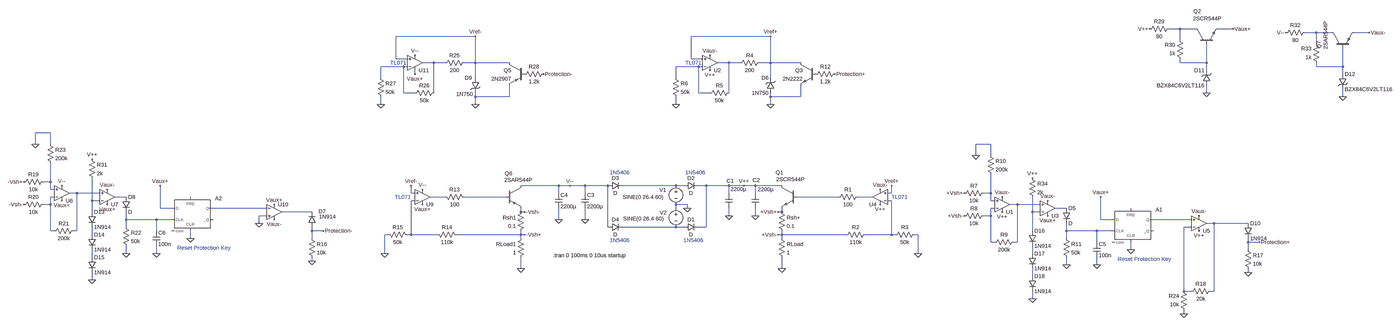
[diagram p0: schematic PSU_Schm.asc, whole sheet]
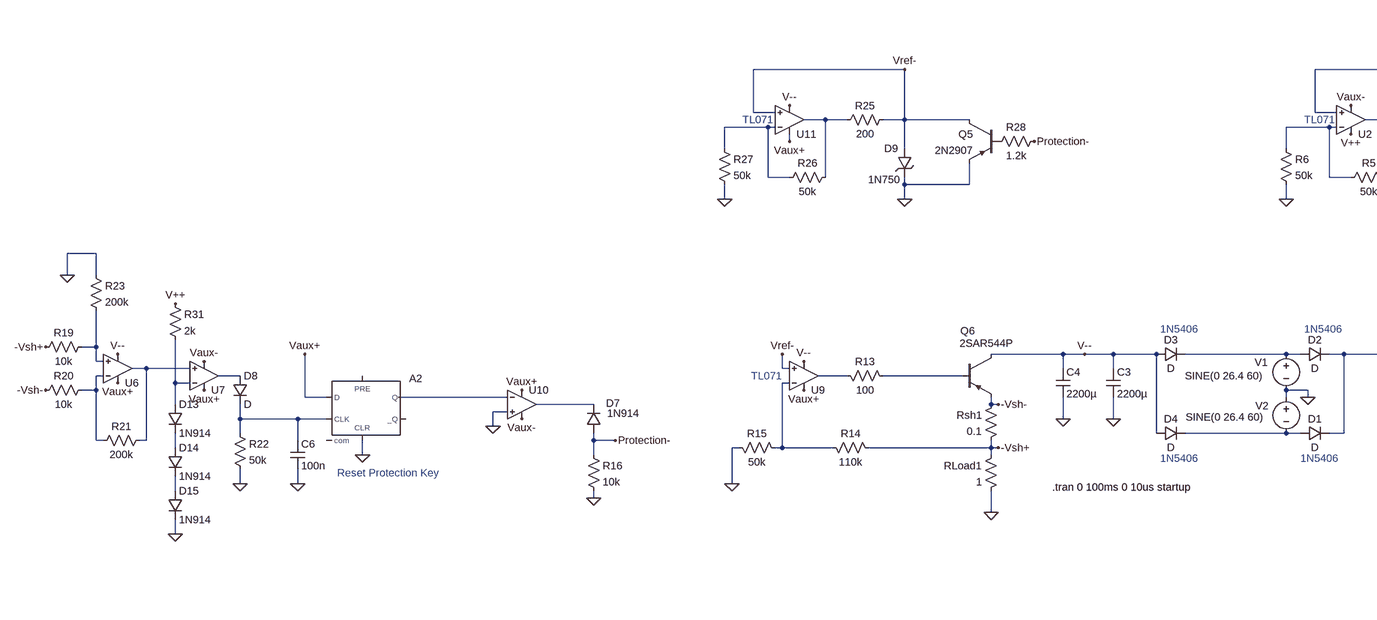
[diagram p1: schematic PSU_Schm.asc, part, row 1 of 1, column 1 of 2]
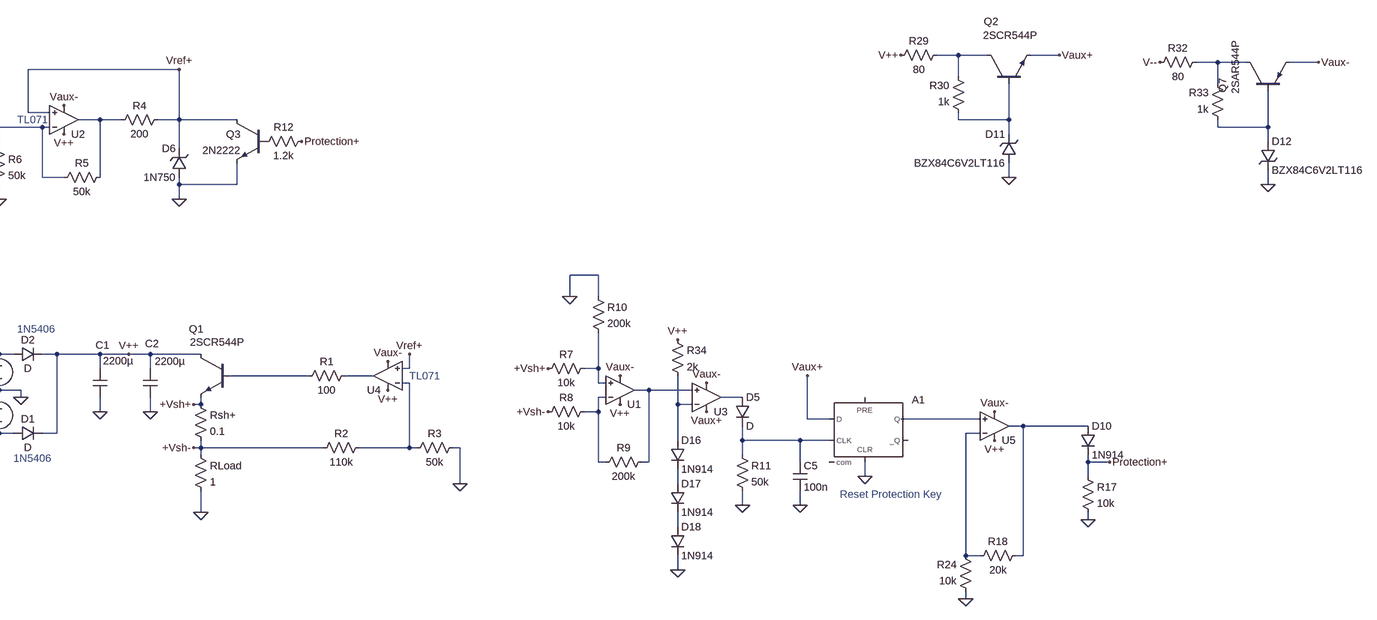
[diagram p2: schematic PSU_Schm.asc, part, row 1 of 1, column 2 of 2]
PSU_Schm.asc, the LTspice schematic file:
Version 4
SHEET 1 3240 692
WIRE 2288 -752 2240 -752
WIRE 2352 -752 2288 -752
WIRE 2512 -752 2448 -752
WIRE 2864 -736 2816 -736
WIRE 2928 -736 2864 -736
WIRE 3088 -736 3024 -736
WIRE -912 -720 -1248 -720
WIRE 336 -720 0 -720
WIRE 2288 -704 2288 -752
WIRE 2864 -688 2864 -736
WIRE -1248 -624 -1248 -720
WIRE -1200 -624 -1248 -624
WIRE 0 -624 0 -720
WIRE 48 -624 0 -624
WIRE -1088 -608 -1136 -608
WIRE -1040 -608 -1088 -608
WIRE -912 -608 -912 -720
WIRE -912 -608 -960 -608
WIRE -768 -608 -912 -608
WIRE 160 -608 112 -608
WIRE 208 -608 160 -608
WIRE 336 -608 336 -720
WIRE 336 -608 288 -608
WIRE 464 -608 336 -608
WIRE 2288 -608 2288 -624
WIRE 2400 -608 2400 -688
WIRE 2400 -608 2288 -608
WIRE -1216 -592 -1312 -592
WIRE -1200 -592 -1216 -592
WIRE 32 -592 -64 -592
WIRE 48 -592 32 -592
WIRE 2864 -592 2864 -608
WIRE 2976 -592 2976 -672
WIRE 2976 -592 2864 -592
WIRE 2400 -576 2400 -608
WIRE -1168 -560 -1168 -576
WIRE 2976 -560 2976 -592
WIRE -1312 -544 -1312 -592
WIRE -912 -544 -912 -608
WIRE -64 -544 -64 -592
WIRE 336 -544 336 -608
WIRE -1216 -480 -1216 -592
WIRE -1168 -480 -1216 -480
WIRE -1088 -480 -1088 -608
WIRE 32 -480 32 -592
WIRE 80 -480 32 -480
WIRE 160 -480 160 -608
WIRE 2400 -480 2400 -512
WIRE -912 -464 -912 -480
WIRE -768 -464 -768 -512
WIRE -768 -464 -912 -464
WIRE 336 -464 336 -480
WIRE 464 -464 464 -512
WIRE 464 -464 336 -464
WIRE 2976 -464 2976 -496
WIRE -1312 -432 -1312 -464
WIRE -912 -432 -912 -464
WIRE -64 -432 -64 -464
WIRE 336 -432 336 -464
WIRE -2944 -144 -3008 -144
WIRE -3008 -96 -3008 -144
WIRE -2944 -96 -2944 -144
WIRE 1488 -96 1424 -96
WIRE 1424 -48 1424 -96
WIRE 1488 -48 1488 -96
WIRE -2944 64 -2944 -16
WIRE -2944 64 -2976 64
WIRE -560 80 -720 80
WIRE -512 80 -560 80
WIRE -448 80 -512 80
WIRE -352 80 -448 80
WIRE -64 80 -288 80
WIRE -32 80 -64 80
WIRE 64 80 32 80
WIRE 160 80 64 80
WIRE 224 80 160 80
WIRE 272 80 224 80
WIRE 384 80 272 80
WIRE -2944 96 -2944 64
WIRE -2928 96 -2944 96
WIRE -2832 112 -2864 112
WIRE -2736 112 -2832 112
WIRE -1184 112 -1184 80
WIRE -1168 112 -1184 112
WIRE -560 112 -560 80
WIRE -448 112 -448 80
WIRE 160 112 160 80
WIRE 272 112 272 80
WIRE 848 112 848 80
WIRE 848 112 832 112
WIRE 1488 112 1488 32
WIRE 1488 112 1456 112
WIRE -2928 128 -2944 128
WIRE -2624 128 -2672 128
WIRE -1040 128 -1104 128
WIRE -784 128 -960 128
WIRE 624 128 448 128
WIRE 768 128 704 128
WIRE -2768 144 -2768 48
WIRE -2736 144 -2768 144
WIRE -1168 144 -1184 144
WIRE 848 144 832 144
WIRE 1488 144 1488 112
WIRE 1504 144 1488 144
WIRE -2944 160 -2944 128
WIRE -2944 160 -2976 160
WIRE -16 160 -64 160
WIRE 1600 160 1568 160
WIRE 1696 160 1600 160
WIRE -2480 176 -2480 80
WIRE -2432 176 -2480 176
WIRE -2000 176 -2272 176
WIRE -64 176 -64 160
WIRE -16 176 -16 160
WIRE 1504 176 1488 176
WIRE 1808 176 1760 176
WIRE -2768 192 -2768 144
WIRE -1808 192 -1936 192
WIRE -720 192 -720 176
WIRE -704 192 -720 192
WIRE 384 192 384 176
WIRE 384 192 368 192
WIRE 1664 192 1664 128
WIRE 1696 192 1664 192
WIRE -2000 208 -2032 208
WIRE 160 208 160 176
WIRE 272 208 272 176
WIRE 1488 208 1488 176
WIRE 1488 208 1456 208
WIRE -2624 224 -2624 192
WIRE -2496 224 -2624 224
WIRE -2432 224 -2496 224
WIRE -560 224 -560 176
WIRE -448 224 -448 176
WIRE 1952 224 1952 128
WIRE 2000 224 1952 224
WIRE 2336 224 2160 224
WIRE -2032 240 -2032 208
WIRE 2432 240 2400 240
WIRE 2576 240 2432 240
WIRE -2624 256 -2624 224
WIRE -352 256 -352 80
WIRE -64 256 -288 256
WIRE -32 256 -64 256
WIRE 64 256 64 80
WIRE 64 256 32 256
WIRE 2336 256 2304 256
WIRE -2944 272 -2944 160
WIRE -2928 272 -2944 272
WIRE -2832 272 -2832 112
WIRE -2832 272 -2848 272
WIRE -2496 272 -2496 224
WIRE -1808 272 -1808 256
WIRE -1760 272 -1808 272
WIRE 1664 272 1664 192
WIRE 1808 272 1808 240
WIRE 1936 272 1808 272
WIRE 2000 272 1936 272
WIRE -2768 288 -2768 256
WIRE -1280 288 -1296 288
WIRE -1184 288 -1184 144
WIRE -1184 288 -1200 288
WIRE -1072 288 -1184 288
WIRE -720 288 -720 272
WIRE -720 288 -992 288
WIRE -704 288 -720 288
WIRE 384 288 384 272
WIRE 384 288 368 288
WIRE 656 288 384 288
WIRE 848 288 848 144
WIRE 848 288 736 288
WIRE 864 288 848 288
WIRE 960 288 944 288
WIRE -2352 304 -2352 272
WIRE -1808 304 -1808 272
WIRE -720 304 -720 288
WIRE 384 304 384 288
WIRE 1808 304 1808 272
WIRE 1488 320 1488 208
WIRE 1504 320 1488 320
WIRE 1600 320 1600 160
WIRE 1600 320 1584 320
WIRE 1936 320 1936 272
WIRE 2576 320 2576 304
WIRE 2624 320 2576 320
WIRE 2080 352 2080 320
WIRE 2576 352 2576 320
WIRE -2624 368 -2624 336
WIRE -2496 368 -2496 336
WIRE -1296 368 -1296 288
WIRE 960 368 960 288
WIRE 1664 368 1664 336
WIRE -2768 384 -2768 352
WIRE -1808 400 -1808 384
WIRE 1808 416 1808 384
WIRE 1936 416 1936 384
WIRE -720 432 -720 384
WIRE 384 432 384 384
WIRE 2576 448 2576 432
WIRE 1664 464 1664 432
WIRE -2768 480 -2768 448
WIRE 2304 528 2304 256
WIRE 2336 528 2304 528
WIRE 2432 528 2432 240
WIRE 2432 528 2416 528
WIRE 1664 560 1664 528
WIRE 2304 624 2304 608
FLAG 160 208 0
FLAG 272 208 0
FLAG -448 224 0
FLAG -560 224 0
FLAG -16 176 0
FLAG 384 432 0
FLAG 224 80 V++
FLAG 800 160 V++
FLAG -512 80 V--
FLAG 800 96 Vaux-
FLAG 960 368 0
FLAG 336 -432 0
FLAG -64 -432 0
FLAG 336 -720 Vref+
FLAG 848 80 Vref+
FLAG 368 192 +Vsh+
FLAG 368 288 +Vsh-
FLAG 1376 112 +Vsh+
FLAG 1376 208 +Vsh-
FLAG 1536 192 V++
FLAG 1536 128 Vaux-
FLAG 1728 208 Vaux+
FLAG 1728 144 Vaux-
FLAG 1808 416 0
FLAG 1952 128 Vaux+
FLAG 2080 352 0
FLAG 1424 -48 0
FLAG 1936 416 0
FLAG 608 -560 Protection+
FLAG -720 432 0
FLAG -1136 160 Vaux+
FLAG -1136 96 V--
FLAG -1296 368 0
FLAG -704 288 -Vsh+
FLAG -704 192 -Vsh-
FLAG -1184 80 Vref-
FLAG 80 -576 V++
FLAG -3056 64 -Vsh+
FLAG -3056 160 -Vsh-
FLAG -2896 144 Vaux+
FLAG -2896 80 V--
FLAG -2704 160 Vaux+
FLAG -2704 96 Vaux-
FLAG -2768 480 0
FLAG -2624 368 0
FLAG -2480 80 Vaux+
FLAG -2352 304 0
FLAG -3008 -96 0
FLAG -2496 368 0
FLAG -912 -432 0
FLAG -1312 -432 0
FLAG -1168 -640 V--
FLAG -624 -560 Protection-
FLAG -1968 224 Vaux-
FLAG -1968 160 Vaux+
FLAG -1760 272 Protection-
FLAG -1808 400 0
FLAG -912 -720 Vref-
FLAG 2368 208 Vaux-
FLAG 2368 272 V++
FLAG 2624 320 Protection+
FLAG 2576 448 0
FLAG 2304 624 0
FLAG -1168 -560 Vaux+
FLAG 80 -640 Vaux-
FLAG -2032 240 0
FLAG 2400 -480 0
FLAG 2160 -752 V++
FLAG 2976 -464 0
FLAG 2736 -736 V--
FLAG 2512 -752 Vaux+
FLAG 3088 -736 Vaux-
FLAG -2768 -32 V++
FLAG 1664 560 0
FLAG 1664 48 V++
SYMBOL cap 144 112 R0
WINDOW 0 6 -52 Left 2
WINDOW 3 23 -17 Left 2
SYMATTR InstName C1
SYMATTR Value 2200µ
SYMBOL cap 256 112 R0
WINDOW 0 4 -55 Left 2
WINDOW 3 26 -16 Left 2
SYMATTR InstName C2
SYMATTR Value 2200µ
SYMBOL diode -32 272 R270
WINDOW 0 32 32 VTop 2
WINDOW 3 0 32 VBottom 2
SYMATTR InstName D1
SYMBOL diode -32 96 R270
WINDOW 0 32 32 VTop 2
WINDOW 3 0 32 VBottom 2
SYMATTR InstName D2
SYMBOL voltage -64 64 R0
WINDOW 0 -70 34 Left 2
WINDOW 3 -225 64 Left 2
WINDOW 123 0 0 Left 0
WINDOW 39 0 0 Left 0
SYMATTR InstName V1
SYMATTR Value SINE(0 26.4 60)
SYMBOL voltage -64 160 R0
WINDOW 0 -68 35 Left 2
WINDOW 3 -223 60 Left 2
WINDOW 123 0 0 Left 0
WINDOW 39 0 0 Left 0
SYMATTR InstName V2
SYMATTR Value SINE(0 26.4 60)
SYMBOL diode -352 96 R270
WINDOW 0 32 32 VTop 2
WINDOW 3 0 32 VBottom 2
SYMATTR InstName D3
SYMBOL diode -352 272 R270
WINDOW 0 32 32 VTop 2
WINDOW 3 0 32 VBottom 2
SYMATTR InstName D4
SYMBOL cap -464 112 R0
SYMATTR InstName C3
SYMATTR Value 2200µ
SYMBOL cap -576 112 R0
SYMATTR InstName C4
SYMATTR Value 2200µ
SYMBOL res 368 288 R0
SYMATTR InstName RLoad
SYMATTR Value 1
SYMBOL res 720 112 R90
WINDOW 0 0 56 VBottom 2
WINDOW 3 32 56 VTop 2
SYMATTR InstName R1
SYMATTR Value 100
SYMBOL res 752 272 R90
WINDOW 0 0 56 VBottom 2
WINDOW 3 32 56 VTop 2
SYMATTR InstName R2
SYMATTR Value 110k
SYMBOL res 960 272 R90
WINDOW 0 0 56 VBottom 2
WINDOW 3 32 56 VTop 2
SYMATTR InstName R3
SYMATTR Value 50k
SYMBOL res 304 -624 R90
WINDOW 0 0 56 VBottom 2
WINDOW 3 32 56 VTop 2
SYMATTR InstName R4
SYMATTR Value 200
SYMBOL res 176 -496 R90
WINDOW 0 0 56 VBottom 2
WINDOW 3 32 56 VTop 2
SYMATTR InstName R5
SYMATTR Value 50k
SYMBOL res -80 -560 R0
SYMATTR InstName R6
SYMATTR Value 50k
SYMBOL npn 448 80 M0
WINDOW 3 -32 -27 Left 2
WINDOW 0 58 -56 Left 2
SYMATTR Value 2SCR544P
SYMATTR InstName Q1
SYMBOL zener 352 -480 R180
WINDOW 0 24 64 Left 2
WINDOW 3 24 0 Left 2
SYMATTR InstName D6
SYMATTR Value 1N750
SYMBOL res 368 176 R0
SYMATTR InstName Rsh+
SYMATTR Value 0.1
SYMBOL res 1472 96 R90
WINDOW 0 0 56 VBottom 2
WINDOW 3 32 56 VTop 2
SYMATTR InstName R7
SYMATTR Value 10k
SYMBOL res 1472 192 R90
WINDOW 0 0 56 VBottom 2
WINDOW 3 32 56 VTop 2
SYMATTR InstName R8
SYMATTR Value 10k
SYMBOL res 1600 304 R90
WINDOW 0 0 56 VBottom 2
WINDOW 3 32 56 VTop 2
SYMATTR InstName R9
SYMATTR Value 200k
SYMBOL diode 1792 176 R0
SYMATTR InstName D5
SYMBOL res 1792 288 R0
SYMATTR InstName R11
SYMATTR Value 50k
SYMBOL Digital\\dflop 2080 176 R0
SYMATTR InstName A1
SYMBOL res 1472 -64 R0
SYMATTR InstName R10
SYMATTR Value 200k
SYMBOL cap 1920 320 R0
SYMATTR InstName C5
SYMATTR Value 100n
SYMBOL npn 528 -608 M0
SYMATTR InstName Q3
SYMATTR Value 2N2222
SYMBOL res 624 -576 R90
WINDOW 0 0 56 VBottom 2
WINDOW 3 32 56 VTop 2
SYMATTR InstName R12
SYMATTR Value 1.2k
SYMBOL res -704 288 M0
SYMATTR InstName RLoad1
SYMATTR Value 1
SYMBOL res -1056 112 M90
WINDOW 0 0 56 VBottom 2
WINDOW 3 32 56 VTop 2
SYMATTR InstName R13
SYMATTR Value 100
SYMBOL res -1088 272 M90
WINDOW 0 0 56 VBottom 2
WINDOW 3 32 56 VTop 2
SYMATTR InstName R14
SYMATTR Value 110k
SYMBOL res -1296 272 M90
WINDOW 0 0 56 VBottom 2
WINDOW 3 32 56 VTop 2
SYMATTR InstName R15
SYMATTR Value 50k
SYMBOL res -704 176 M0
SYMATTR InstName Rsh1
SYMATTR Value 0.1
SYMBOL pnp -784 80 R0
WINDOW 0 -4 -52 Left 2
WINDOW 3 -6 -24 Left 2
SYMATTR InstName Q6
SYMATTR Value 2SAR544P
SYMBOL res -2960 48 R90
WINDOW 0 0 56 VBottom 2
WINDOW 3 32 56 VTop 2
SYMATTR InstName R19
SYMATTR Value 10k
SYMBOL res -2960 144 R90
WINDOW 0 0 56 VBottom 2
WINDOW 3 32 56 VTop 2
SYMATTR InstName R20
SYMATTR Value 10k
SYMBOL res -2832 256 R90
WINDOW 0 0 56 VBottom 2
WINDOW 3 32 56 VTop 2
SYMATTR InstName R21
SYMATTR Value 200k
SYMBOL diode -2640 128 R0
SYMATTR InstName D8
SYMBOL res -2640 240 R0
SYMATTR InstName R22
SYMATTR Value 50k
SYMBOL Digital\\dflop -2352 128 R0
SYMATTR InstName A2
SYMBOL res -2960 -112 R0
SYMATTR InstName R23
SYMATTR Value 200k
SYMBOL cap -2512 272 R0
SYMATTR InstName C6
SYMATTR Value 100n
SYMBOL res -944 -624 R90
WINDOW 0 0 56 VBottom 2
WINDOW 3 32 56 VTop 2
SYMATTR InstName R25
SYMATTR Value 200
SYMBOL res -1072 -496 R90
WINDOW 0 0 56 VBottom 2
WINDOW 3 32 56 VTop 2
SYMATTR InstName R26
SYMATTR Value 50k
SYMBOL res -1328 -560 R0
SYMATTR InstName R27
SYMATTR Value 50k
SYMBOL zener -928 -544 R0
WINDOW 0 -29 0 Left 2
WINDOW 3 -65 69 Left 2
SYMATTR InstName D9
SYMATTR Value 1N750
SYMBOL res -608 -576 R90
WINDOW 0 0 56 VBottom 2
WINDOW 3 32 56 VTop 2
SYMATTR InstName R28
SYMATTR Value 1.2k
SYMBOL pnp -704 -608 M0
SYMATTR InstName Q5
SYMATTR Value 2N2907
SYMBOL diode -1792 256 R180
WINDOW 0 -42 67 Left 2
WINDOW 3 -85 44 Left 2
SYMATTR InstName D7
SYMATTR Value 1N914
SYMBOL res -1824 288 R0
SYMATTR InstName R16
SYMATTR Value 10k
SYMBOL diode 2560 240 R0
SYMATTR InstName D10
SYMATTR Value 1N914
SYMBOL res 2560 336 R0
SYMATTR InstName R17
SYMATTR Value 10k
SYMBOL res 2432 512 R90
WINDOW 0 0 56 VBottom 2
WINDOW 3 32 56 VTop 2
SYMATTR InstName R18
SYMATTR Value 20k
SYMBOL res 2320 624 R180
WINDOW 0 36 76 Left 2
WINDOW 3 36 40 Left 2
SYMATTR InstName R24
SYMATTR Value 10k
SYMBOL Opamps\\UniversalOpamp2 -1168 -608 M180
SYMATTR InstName U11
SYMBOL Opamps\\UniversalOpamp2 80 -608 M180
SYMATTR InstName U2
SYMBOL Opamps\\UniversalOpamp2 -1136 128 M180
SYMATTR InstName U9
SYMBOL Opamps\\UniversalOpamp2 800 128 R180
SYMATTR InstName U4
SYMBOL Opamps\\UniversalOpamp2 1536 160 M180
SYMATTR InstName U1
SYMBOL Opamps\\UniversalOpamp2 1728 176 M180
SYMATTR InstName U3
SYMBOL Opamps\\UniversalOpamp2 2368 240 M180
SYMATTR InstName U5
SYMBOL Opamps\\UniversalOpamp2 -1968 192 R0
SYMATTR InstName U10
SYMBOL Opamps\\UniversalOpamp2 -2896 112 M180
SYMATTR InstName U6
SYMBOL Opamps\\UniversalOpamp2 -2704 128 M180
SYMATTR InstName U7
SYMBOL res 2256 -768 R90
WINDOW 0 0 56 VBottom 2
WINDOW 3 32 56 VTop 2
SYMATTR InstName R29
SYMATTR Value 80
SYMBOL res 2304 -608 R180
WINDOW 0 36 76 Left 2
WINDOW 3 36 40 Left 2
SYMATTR InstName R30
SYMATTR Value 1k
SYMBOL npn 2352 -688 R270
WINDOW 3 108 -9 VRight 2
WINDOW 0 139 -8 VRight 2
SYMATTR Value 2SCR544P
SYMATTR InstName Q2
SYMBOL zener 2416 -512 R180
WINDOW 0 24 64 Left 2
WINDOW 3 24 0 Left 2
SYMATTR InstName D11
SYMATTR Value BZX84C6V2LT116
SYMBOL res 2832 -752 R90
WINDOW 0 0 56 VBottom 2
WINDOW 3 32 56 VTop 2
SYMATTR InstName R32
SYMATTR Value 80
SYMBOL res 2880 -592 R180
WINDOW 0 36 76 Left 2
WINDOW 3 36 40 Left 2
SYMATTR InstName R33
SYMATTR Value 1k
SYMBOL zener 2960 -560 R0
SYMATTR InstName D12
SYMATTR Value BZX84C6V2LT116
SYMBOL pnp 2928 -672 R270
WINDOW 0 -4 -52 Left 2
WINDOW 3 -6 -24 Left 2
SYMATTR InstName Q7
SYMATTR Value 2SAR544P
SYMBOL res -2784 -48 R0
SYMATTR InstName R31
SYMATTR Value 2k
SYMBOL diode -2784 192 R0
SYMATTR InstName D13
SYMATTR Value 1N914
SYMBOL diode -2784 288 R0
SYMATTR InstName D14
SYMATTR Value 1N914
SYMBOL diode -2784 384 R0
SYMATTR InstName D15
SYMATTR Value 1N914
SYMBOL res 1648 32 R0
SYMATTR InstName R34
SYMATTR Value 2k
SYMBOL diode 1648 272 R0
SYMATTR InstName D16
SYMATTR Value 1N914
SYMBOL diode 1648 368 R0
SYMATTR InstName D17
SYMATTR Value 1N914
SYMBOL diode 1648 464 R0
SYMATTR InstName D18
SYMATTR Value 1N914
TEXT -24 -608 Left 2 ;TL071
TEXT 848 128 Left 2 ;TL071
TEXT -24 24 Left 2 ;1N5406
TEXT -32 312 Left 2 ;1N5406
TEXT -344 24 Left 2 ;1N5406
TEXT -344 312 Left 2 ;1N5406
TEXT -584 376 Left 2 !.tran 0 100ms 0 10us startup
TEXT 2024 392 Left 2 ;Reset Protection Key
TEXT -1184 128 Right 2 ;TL071
TEXT -1272 -608 Left 2 ;TL071
TEXT -2408 344 Left 2 ;Reset Protection Key
TEXT -1272 -608 Left 2 ;TL071

The netlist it stands for:
* PSU_Schm.asc
C1 V++ 0 2200µ
C2 V++ 0 2200µ
D1 N031 V++ D
D2 N010 V++ D
V1 N010 0 SINE(0 26.4 60)
V2 0 N031 SINE(0 26.4 60)
D3 V-- N010 D
D4 V-- N031 D
C3 V-- 0 2200µ
C4 V-- 0 2200µ
RLoad +Vsh- 0 1
R1 N018 N017 100
R2 N021 +Vsh- 110k
R3 0 N021 50k
R4 Vref+ N004 200
R5 N004 N007 50k
R6 N007 0 50k
Q1 V++ N017 +Vsh+ 0 2SCR544P
D6 0 Vref+ 1N750
Rsh+ +Vsh+ +Vsh- 0.1
R7 N012 +Vsh+ 10k
R8 N024 +Vsh- 10k
R9 N022 N024 200k
D5 N025 N033 D
R11 N033 0 50k
A1 Vaux+ 0 N033 0 0 0 N029 0 DFLOP
R10 0 N012 200k
C5 N033 0 100n
Q3 Vref+ P001 0 0 2N2222
R12 Protection+ P001 1.2k
RLoad1 -Vsh+ 0 1
R13 N015 N016 100
R14 N020 -Vsh+ 110k
R15 0 N020 50k
Rsh1 -Vsh- -Vsh+ 0.1
Q6 V-- N016 -Vsh- 0 2SAR544P
R19 N009 -Vsh+ 10k
R20 N013 -Vsh- 10k
R21 N011 N013 200k
D8 N014 N028 D
R22 N028 0 50k
A2 Vaux+ 0 N028 0 0 0 N023 0 DFLOP
R23 0 N009 200k
C6 N028 0 100n
R25 Vref- N003 200
R26 N003 N006 50k
R27 N006 0 50k
D9 Vref- 0 1N750
R28 Protection- P002 1.2k
Q5 Vref- P002 0 0 2N2907
D7 Protection- N026 1N914
R16 Protection- 0 10k
D10 N030 Protection+ 1N914
R17 Protection+ 0 10k
R18 N030 N032 20k
R24 0 N032 10k
XU11 Vref- N006 Vaux+ V-- N003 level.2 Avol=1Meg GBW=10Meg Slew=10Meg ilimit=25m rail=0 Vos=0 phimargin=45 en=0 enk=0 in=0 ink=0 Rin=500Meg  ; pins IN+ IN- V+ V- OUT
XU2 Vref+ N007 V++ Vaux- N004 level.2 Avol=1Meg GBW=10Meg Slew=10Meg ilimit=25m rail=0 Vos=0 phimargin=45 en=0 enk=0 in=0 ink=0 Rin=500Meg  ; pins IN+ IN- V+ V- OUT
XU9 Vref- N020 Vaux+ V-- N015 level.2 Avol=1Meg GBW=10Meg Slew=10Meg ilimit=25m rail=0 Vos=0 phimargin=45 en=0 enk=0 in=0 ink=0 Rin=500Meg  ; pins IN+ IN- V+ V- OUT
XU4 Vref+ N021 V++ Vaux- N018 level.2 Avol=1Meg GBW=10Meg Slew=10Meg ilimit=25m rail=0 Vos=0 phimargin=45 en=0 enk=0 in=0 ink=0 Rin=500Meg  ; pins IN+ IN- V+ V- OUT
XU1 N012 N024 V++ Vaux- N022 level.2 Avol=1Meg GBW=10Meg Slew=10Meg ilimit=25m rail=0 Vos=0 phimargin=45 en=0 enk=0 in=0 ink=0 Rin=500Meg  ; pins IN+ IN- V+ V- OUT
XU3 N022 N027 Vaux+ Vaux- N025 level.2 Avol=1Meg GBW=10Meg Slew=10Meg ilimit=25m rail=0 Vos=0 phimargin=45 en=0 enk=0 in=0 ink=0 Rin=500Meg  ; pins IN+ IN- V+ V- OUT
XU5 N029 N032 V++ Vaux- N030 level.2 Avol=1Meg GBW=10Meg Slew=10Meg ilimit=25m rail=0 Vos=0 phimargin=45 en=0 enk=0 in=0 ink=0 Rin=500Meg  ; pins IN+ IN- V+ V- OUT
XU10 0 N023 Vaux+ Vaux- N026 level.2 Avol=1Meg GBW=10Meg Slew=10Meg ilimit=25m rail=0 Vos=0 phimargin=45 en=0 enk=0 in=0 ink=0 Rin=500Meg  ; pins IN+ IN- V+ V- OUT
XU6 N009 N013 Vaux+ V-- N011 level.2 Avol=1Meg GBW=10Meg Slew=10Meg ilimit=25m rail=0 Vos=0 phimargin=45 en=0 enk=0 in=0 ink=0 Rin=500Meg  ; pins IN+ IN- V+ V- OUT
XU7 N011 N019 Vaux+ Vaux- N014 level.2 Avol=1Meg GBW=10Meg Slew=10Meg ilimit=25m rail=0 Vos=0 phimargin=45 en=0 enk=0 in=0 ink=0 Rin=500Meg  ; pins IN+ IN- V+ V- OUT
R29 N001 V++ 80
R30 N005 N001 1k
Q2 N001 N005 Vaux+ 0 2SCR544P
D11 0 N005 BZX84C6V2LT116
R32 N002 V-- 80
R33 N008 N002 1k
D12 N008 0 BZX84C6V2LT116
Q7 N002 N008 Vaux- 0 2SAR544P
R31 V++ N019 2k
D13 N019 N034 1N914
D14 N034 N036 1N914
D15 N036 0 1N914
R34 V++ N027 2k
D16 N027 N035 1N914
D17 N035 N037 1N914
D18 N037 0 1N914
.model D D
.lib standard.dio
.model NPN NPN
.model PNP PNP
.lib standard.bjt
* TL071
* TL071
* 1N5406
* 1N5406
* 1N5406
* 1N5406
.tran 0 100ms 0 10us startup
* Reset Protection Key
* TL071
* TL071
* Reset Protection Key
* TL071
.lib UniversalOpamps2.sub
.backanno
.end